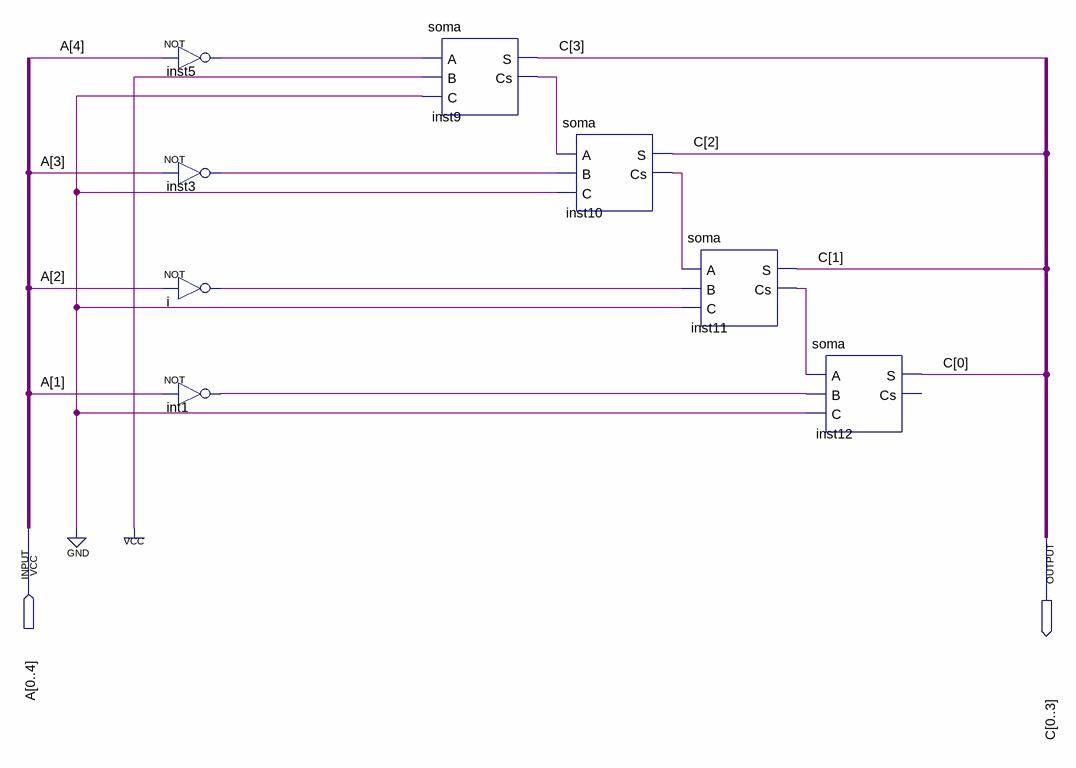
[diagram p0: schematic sheet]
// Quartus schematic comp2S.bdf as structural Verilog: 8 symbols, 2 pins
module comp2S (
  input  [0:4] A,
  output [0:3] C
);

  wire i_out, inst3_out, inst5_out, inst9_cs, inst10_cs, inst11_cs, int1_out;

  not inst5 (inst5_out, A[4]);
  not inst3 (inst3_out, A[3]);
  not i (i_out, A[2]);
  not int1 (int1_out, A[1]);
  soma inst9 (.A(inst5_out), .B(1'b1), .C(1'b0), .S(C[3]), .Cs(inst9_cs));
  soma inst10 (.A(inst9_cs), .B(inst3_out), .C(1'b0), .S(C[2]), .Cs(inst10_cs));
  soma inst11 (.A(inst10_cs), .B(i_out), .C(1'b0), .S(C[1]), .Cs(inst11_cs));
  soma inst12 (.A(inst11_cs), .B(int1_out), .C(1'b0), .S(C[0]));  // open: Cs
endmodule
